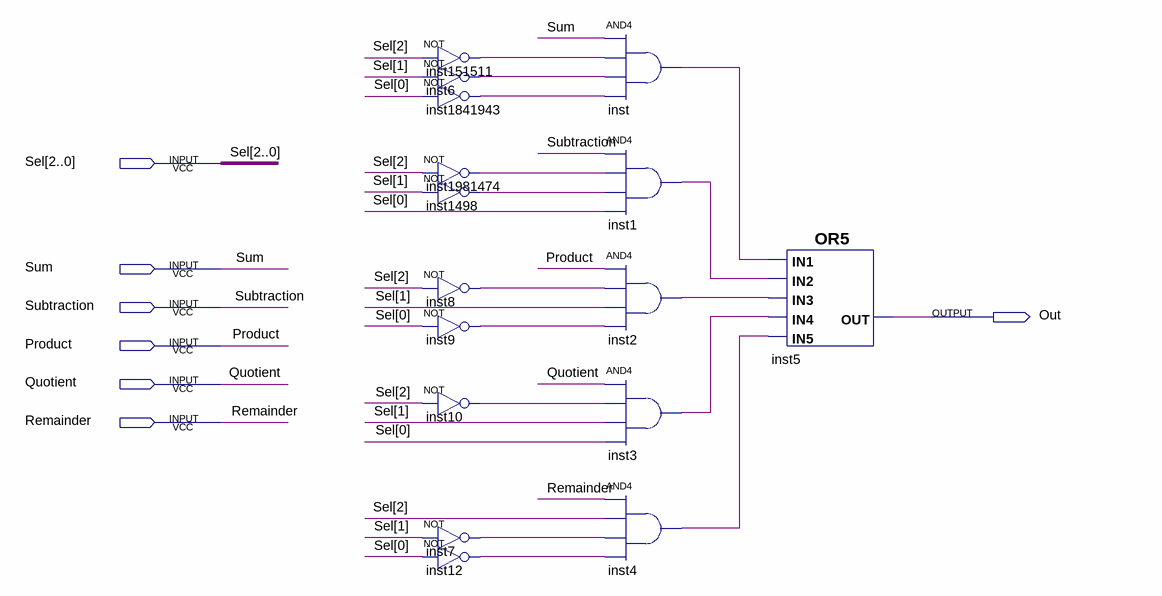
[diagram p0: schematic sheet]
// Quartus schematic Mux5Operations.bdf as structural Verilog: 16 symbols, 7 pins
module Mux5Operations (
  input  [2:0] Sel,
  input  Sum,
  input  Subtraction,
  input  Product,
  input  Quotient,
  input  Remainder,
  output Out
);

  wire inst1_out, inst2_out, inst3_out, inst4_out, inst6_out, inst7_out, inst8_out, inst9_out, inst10_out,
       inst12_out, inst1498_out, inst151511_out, inst1841943_out, inst1981474_out, inst_out;

  not inst151511 (inst151511_out, Sel[2]);
  not inst6 (inst6_out, Sel[1]);
  not inst1841943 (inst1841943_out, Sel[0]);
  not inst1981474 (inst1981474_out, Sel[2]);
  not inst1498 (inst1498_out, Sel[1]);
  not inst8 (inst8_out, Sel[2]);
  not inst9 (inst9_out, Sel[0]);
  not inst10 (inst10_out, Sel[2]);
  not inst7 (inst7_out, Sel[1]);
  not inst12 (inst12_out, Sel[0]);
  and inst (inst_out, Sum, inst151511_out, inst6_out, inst1841943_out);
  and inst1 (inst1_out, Subtraction, inst1981474_out, inst1498_out, Sel[0]);
  and inst2 (inst2_out, Product, inst8_out, Sel[1], inst9_out);
  and inst3 (inst3_out, Quotient, inst10_out, Sel[1], Sel[0]);
  and inst4 (inst4_out, Remainder, Sel[2], inst7_out, inst12_out);
  or inst5 (Out, inst_out, inst1_out, inst2_out, inst3_out, inst4_out);
endmodule
